# Altium schematic sheet Card Edge Connecgtor.SchDoc: Card Edge Connector
size 292 x 193 mm; SheetNumber: 2; SheetTotal: 12
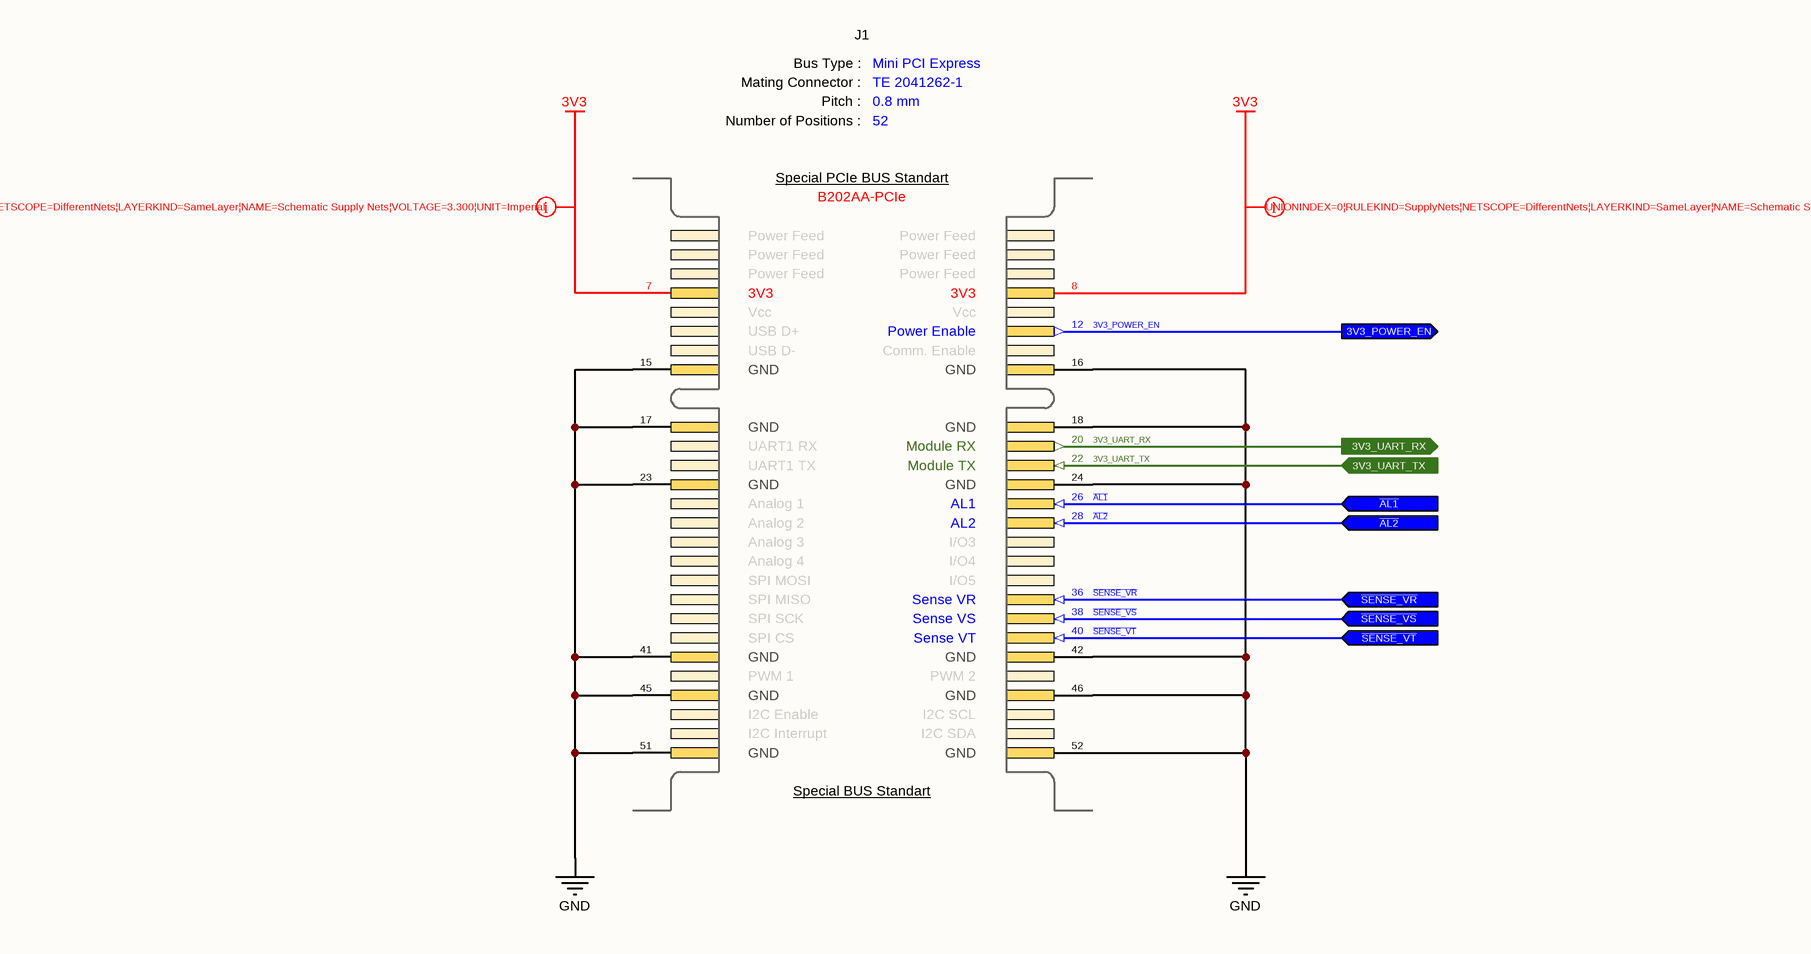
[diagram p0: Card Edge Connecgtor.SchDoc]

## Parts
J1  BUS Type: Mini PCI Express  Mating Connector: TE 2041262-1  Pitch: 0.8 mm  Number of Positions: 52  [PCB - Mini PCI Express]  (hidden comment: Connector - Mini PCI-E (Male B202AA-PCIe))  (no BOM)

## Ports
3V3_POWER_EN (out), 3V3_UART_RX (out), 3V3_UART_TX (in), ~{AL1} (in), ~{AL2} (in), ~{SENSE_VR} (in), ~{SENSE_VS} (in), ~{SENSE_VT} (in)

## Nets
3V3: J1.7(Pin-7) J1.8(Pin-8)
GND: J1.15(Pin-15) J1.16(Pin-16) J1.17(Pin-17) J1.18(Pin-18) J1.23(Pin-23) J1.24(Pin-24) J1.41(Pin-41) J1.42(Pin-42) J1.45(Pin-45) J1.46(Pin-46) J1.51(Pin-51) J1.52(Pin-52)
3V3_POWER_EN: J1.12(Pin-12) ; port 3V3_POWER_EN
3V3_UART_RX: J1.20(Pin-20) ; port 3V3_UART_RX
3V3_UART_TX: J1.22(Pin-22) ; port 3V3_UART_TX
~{AL1}: J1.26(Pin-26) ; port ~{AL1}
~{AL2}: J1.28(Pin-28) ; port ~{AL2}
~{SENSE_VR}: J1.36(Pin-36) ; port ~{SENSE_VR}
~{SENSE_VS}: J1.38(Pin-38) ; port ~{SENSE_VS}
~{SENSE_VT}: J1.40(Pin-40) ; port ~{SENSE_VT}

## Layout directives
rule Supply Nets [Voltage = 3.300]: 3V3

## Notes on the sheet
- © 2021 All rights reserved.
  This document may not, in whole or in part, be copied, photocopied, reproduced, translated or converted to any electronic or machine readable from without prior written permission of Mehmet Günce Akkoyun.
  Engineer contact : akkoyun@me.com
- Property of
- Engineer :
- Date :
- Size :
- A4
- Time :
- Project :
- Page :
- /
- Customer :
- Product ID :
- Module ID :
- Version :
- File :
- Revision :
- (in symbol Connector - Mini PCI-E (Male B202AA-PCIe)) Bus Type :; Mating Connector :; Pitch :; Number of Positions :; Special PCIe BUS Standart; B202AA-PCIe; Power Feed; 3V3; Vcc; USB D+; Power Enable; USB D-; Comm. Enable; GND; UART1 RX; Module RX; UART1 TX; Module TX; Analog 1; AL1; Analog 2; AL2; Analog 3; I/O3; Analog 4; I/O4; SPI MOSI; I/O5; SPI MISO; Sense VR; SPI SCK; Sense VS; SPI CS; Sense VT; PWM 1; PWM 2; I2C Enable; I2C SCL; I2C Interrupt; I2C SDA; Special BUS Standart

## Library data of the parts
J1 = Connector - Mini PCI-E (Male B202AA-PCIe): Mini PCI-Express gold finger connector.; System: Connector